# EAGLE design Rapide7seg (EAGLE 6.3)
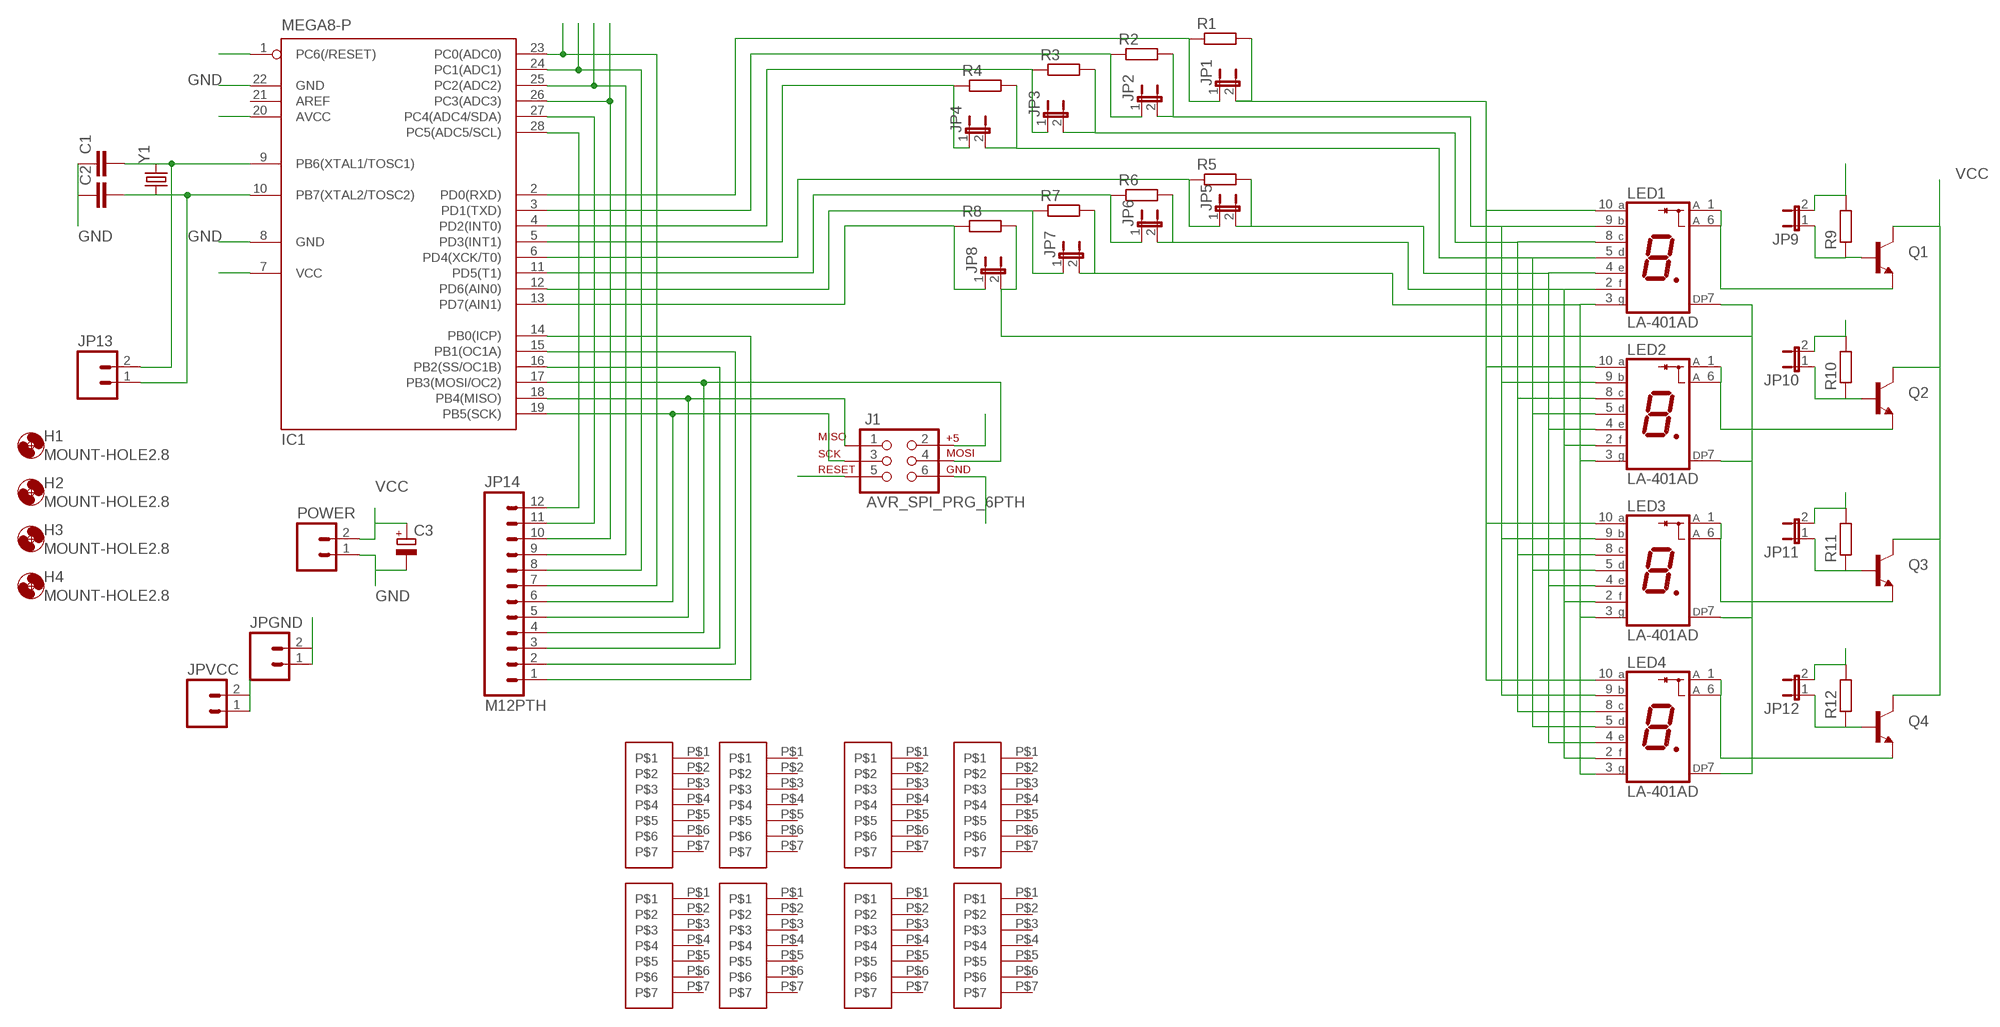
[diagram p0: schematic, sheet 1]

## Parts
C1  C-EU025-024X044  [C025-024X044]
C2  C-EU025-024X044  [C025-024X044]
C3  CPOL-EUE1.8-4  [E1,8-4]
H1  MOUNT-HOLE2.8  [2,8]
H2  MOUNT-HOLE2.8  [2,8]
H3  MOUNT-HOLE2.8  [2,8]
H4  MOUNT-HOLE2.8  [2,8]
IC1  MEGA8-P  [DIL28-3]
J1  AVR_SPI_PRG_6PTH  [2X3]
JP1  JUMPER-2SMD-NO  [SJ_2S-NO]
JP2  JUMPER-2SMD-NO  [SJ_2S-NO]
JP3  JUMPER-2SMD-NO  [SJ_2S-NO]
JP4  JUMPER-2SMD-NO  [SJ_2S-NO]
JP5  JUMPER-2SMD-NO  [SJ_2S-NO]
JP6  JUMPER-2SMD-NO  [SJ_2S-NO]
JP7  JUMPER-2SMD-NO  [SJ_2S-NO]
JP8  JUMPER-2SMD-NO  [SJ_2S-NO]
JP9  JUMPER-2SMD-NO  [SJ_2S-NO]
JP10  JUMPER-2SMD-NO  [SJ_2S-NO]
JP11  JUMPER-2SMD-NO  [SJ_2S-NO]
JP12  JUMPER-2SMD-NO  [SJ_2S-NO]
JP13  M02LOCK  [1X02_LOCK]
JP14  M12PTH  [1X12]
JPGND  M02PTH  [1X02]
JPVCC  M02PTH  [1X02]
LED1  LA-401AD  [LA-401]
LED2  LA-401AD  [LA-401]
LED3  LA-401AD  [LA-401]
LED4  LA-401AD  [LA-401]
POWER  M02LOCK_LONGPADS  [1X02_LOCK_LONGPADS]
Q1  TRANSISTOR_NPNTO92  [TO-92]
Q2  TRANSISTOR_NPNTO92  [TO-92]
Q3  TRANSISTOR_NPNTO92  [TO-92]
Q4  TRANSISTOR_NPNTO92  [TO-92]
R1  R-EU_0204/7  [0204/7]
R2  R-EU_0204/7  [0204/7]
R3  R-EU_0204/7  [0204/7]
R4  R-EU_0204/7  [0204/7]
R5  R-EU_0204/7  [0204/7]
R6  R-EU_0204/7  [0204/7]
R7  R-EU_0204/7  [0204/7]
R8  R-EU_0204/7  [0204/7]
R9  R-EU_0204/7  [0204/7]
R10  R-EU_0204/7  [0204/7]
R11  R-EU_0204/7  [0204/7]
R12  R-EU_0204/7  [0204/7]
U$1  M7_NOSILK  [M7_NOSILK]
U$2  M7_NOSILK  [M7_NOSILK]
U$3  M7_NOSILK  [M7_NOSILK]
U$4  M7_NOSILK  [M7_NOSILK]
U$5  M7_NOSILK  [M7_NOSILK]
U$6  M7_NOSILK  [M7_NOSILK]
U$7  M7_NOSILK  [M7_NOSILK]
U$8  M7_NOSILK  [M7_NOSILK]
Y1  CRYSTALHC49UV  [HC49U-V]

## Nets
GND: C1.1 C2.1 C3.- IC1.8(GND) IC1.22(GND) J1.6 JPGND.1 JPGND.2 POWER.1
L1: IC1.23(PC0(ADC0)) JP9.2 JP14.7 R9.2
L2: IC1.24(PC1(ADC1)) JP10.2 JP14.8 R10.2
L3: IC1.25(PC2(ADC2)) JP11.2 JP14.9 R11.2
L4: IC1.26(PC3(ADC3)) JP12.2 JP14.10 R12.2
N$1: C1.2 IC1.9(PB6(XTAL1/TOSC1)) JP13.2 Y1.2
N$2: C2.2 IC1.10(PB7(XTAL2/TOSC2)) JP13.1 Y1.1
N$3: IC1.18(PB4(MISO)) J1.1 JP14.5
N$4: IC1.19(PB5(SCK)) J1.3 JP14.6
N$5: IC1.17(PB3(MOSI/OC2)) J1.4 JP14.4
N$6: JP12.1 Q4.2(B) R12.1
N$7: JP11.1 Q3.2(B) R11.1
N$8: JP10.1 Q2.2(B) R10.1
N$9: JP1.2 LED1.10(A) LED2.10(A) LED3.10(A) LED4.10(A) R1.2
N$10: IC1.2(PD0(RXD)) JP1.1 R1.1
N$11: JP2.2 LED1.9(B) LED2.9(B) LED3.9(B) LED4.9(B) R2.2
N$12: IC1.3(PD1(TXD)) JP2.1 R2.1
N$13: JP3.2 LED1.8(C) LED2.8(C) LED3.8(C) LED4.8(C) R3.2
N$14: IC1.4(PD2(INT0)) JP3.1 R3.1
N$15: JP4.2 LED1.5(D) LED2.5(D) LED3.5(D) LED4.5(D) R4.2
N$16: IC1.5(PD3(INT1)) JP4.1 R4.1
N$17: IC1.13(PD7(AIN1)) JP8.1 R8.1
N$18: JP8.2 LED1.7(DP) LED2.7(DP) LED3.7(DP) LED4.7(DP) R8.2
N$19: IC1.12(PD6(AIN0)) JP7.1 R7.1
N$20: JP7.2 LED1.3(G) LED2.3(G) LED3.3(G) LED4.3(G) R7.2
N$21: IC1.11(PD5(T1)) JP6.1 R6.1
N$22: JP6.2 LED1.2(F) LED2.2(F) LED3.2(F) LED4.2(F) R6.2
N$23: IC1.6(PD4(XCK/T0)) JP5.1 R5.1
N$24: JP5.2 LED1.4(E) LED2.4(E) LED3.4(E) LED4.4(E) R5.2
N$25: LED1.1(A) LED1.6(A) Q1.1(E)
N$26: LED2.1(A) LED2.6(A) Q2.1(E)
N$27: LED3.1(A) LED3.6(A) Q3.1(E)
N$28: LED4.1(A) LED4.6(A) Q4.1(E)
N$29: JP9.1 Q1.2(B) R9.1
N$30: IC1.28(PC5(ADC5/SCL)) JP14.12
N$31: IC1.27(PC4(ADC4/SDA)) JP14.11
N$32: IC1.16(PB2(SS/OC1B)) JP14.3
N$33: IC1.15(PB1(OC1A)) JP14.2
N$34: IC1.14(PB0(ICP)) JP14.1
UCRESET: IC1.1(PC6(/RESET)) J1.5
VCC: C3.+ IC1.7(VCC) IC1.20(AVCC) J1.2 JPVCC.1 POWER.2 Q1.3(C) Q2.3(C) Q3.3(C) Q4.3(C)
Unconnected: IC1.21(AREF) JPVCC.2 U$1.P$1 U$1.P$2 U$1.P$3 U$1.P$4 U$1.P$5 U$1.P$6 U$1.P$7 U$2.P$1 U$2.P$2 U$2.P$3 U$2.P$4 U$2.P$5 U$2.P$6 U$2.P$7 U$3.P$1 U$3.P$2 U$3.P$3 U$3.P$4 U$3.P$5 U$3.P$6 U$3.P$7 U$4.P$1 U$4.P$2 U$4.P$3 U$4.P$4 U$4.P$5 U$4.P$6 U$4.P$7 U$5.P$1 U$5.P$2 U$5.P$3 U$5.P$4 U$5.P$5 U$5.P$6 U$5.P$7 U$6.P$1 U$6.P$2 U$6.P$3 U$6.P$4 U$6.P$5 U$6.P$6 U$6.P$7 U$7.P$1 U$7.P$2 U$7.P$3 U$7.P$4 U$7.P$5 U$7.P$6 U$7.P$7 U$8.P$1 U$8.P$2 U$8.P$3 U$8.P$4 U$8.P$5 U$8.P$6 U$8.P$7

## Library data of the parts
C1 C2 = resistor:C-EU: CAPACITOR, European symbol
C3 = resistor:CPOL-EU: POLARIZED CAPACITOR, European symbol
H1-H4 = holes:MOUNT-HOLE: MOUNTING HOLE with drill center marker
IC1 = atmel:MEGA8-P: MICROCONTROLLER 8 Kbytes FLASH, 1 kbytes SRAM, 512 bytes EEPROM, USART, 4-channel 10 bit ADC, 2-channel 8 bit ADC Pin compatible with Atmega48, ATMega88, ATMega168 Source: avr.lbr; OC_FARNELL: unknown; OC_NEWARK: unknown
J1 = SparkFun:AVR_SPI_PRG_6: AVR ISP 6 Pin This is the reduced ISP connector for AVR programming. Common on Arduino. This footprint will take up less PCB space and can be used with a 10-pin to 6-pin adapter such as SKU: BOB-08508
JP1-JP12 = SparkFun:JUMPER-2: Jumper Basic 0.1" spaced jumper. Use with breakaway headers.
JP13 JPGND JPVCC POWER = SparkFun:M02: Header 2 Standard 2-pin 0.1" header. Use with straight break away headers (SKU : PRT-00116), right angle break away headers (PRT-00553), swiss pins (PRT-00743), machine pins (PRT-00117), and female headers (PRT-00115). Molex polarized connector foot print use with SKU : PRT-08233 with associated crimp pins and housings.
JP14 = SparkFun:M12: Header 12 Standard 12-pin 0.1" header. Use with straight break away headers (SKU : PRT-00116), right angle break away headers (PRT-00553), swiss pins (PRT-00743), machine pins (PRT-00117), and female headers (PRT-00115).
LED1-LED4 = led-7-segment:LA-401*D: Single Digit LED Numeric Display (anode common) Source: ROHM .. la-1401dn.pdf; OC_FARNELL: unknown; OC_NEWARK: unknown
Q1-Q4 = SparkFun:TRANSISTOR_NPN: Transistor NPN BJT configuration in SOT23 package. MMBT2222 is the common NPN we use. Double check BCE configuration again layout.
R1-R12 = resistor:R-EU_: RESISTOR, European symbol
U$1-U$8 = kalshagar:M7_NOSILK
Y1 = SparkFun:CRYSTAL: Crystals Various standard crystals. Proven footprints. Spark Fun Electronics SKU : COM-00534

## Board
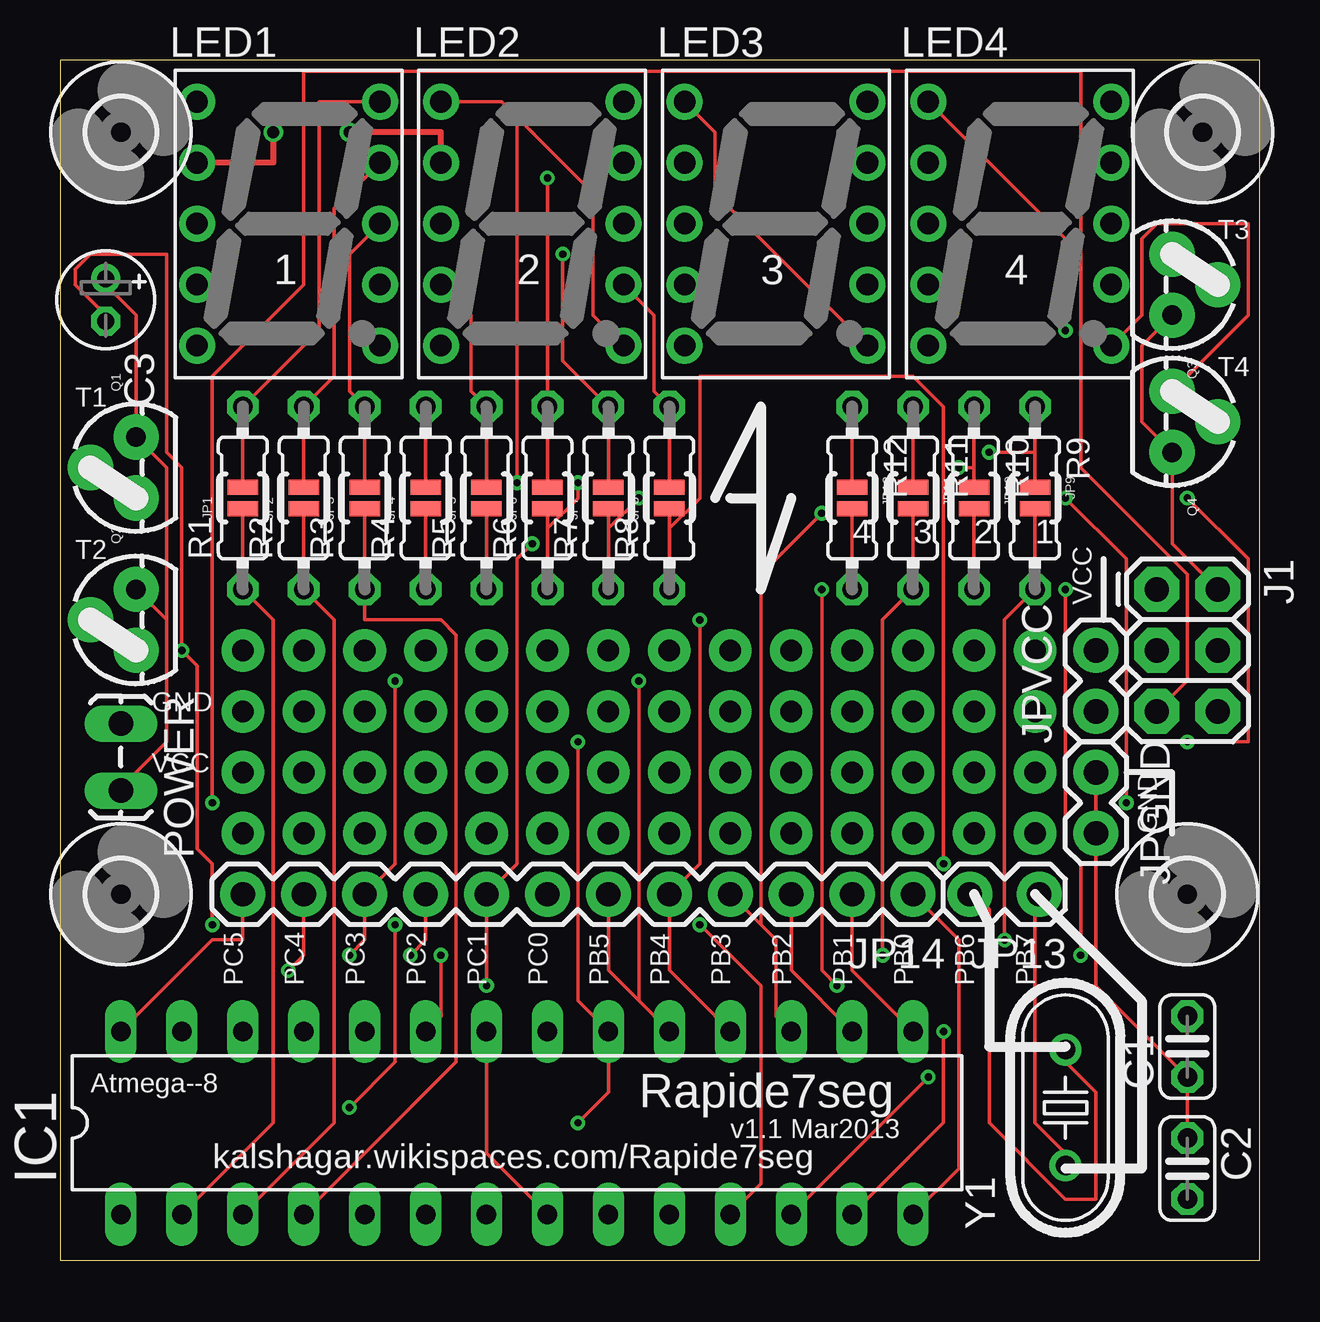
[diagram p1: board, top side]
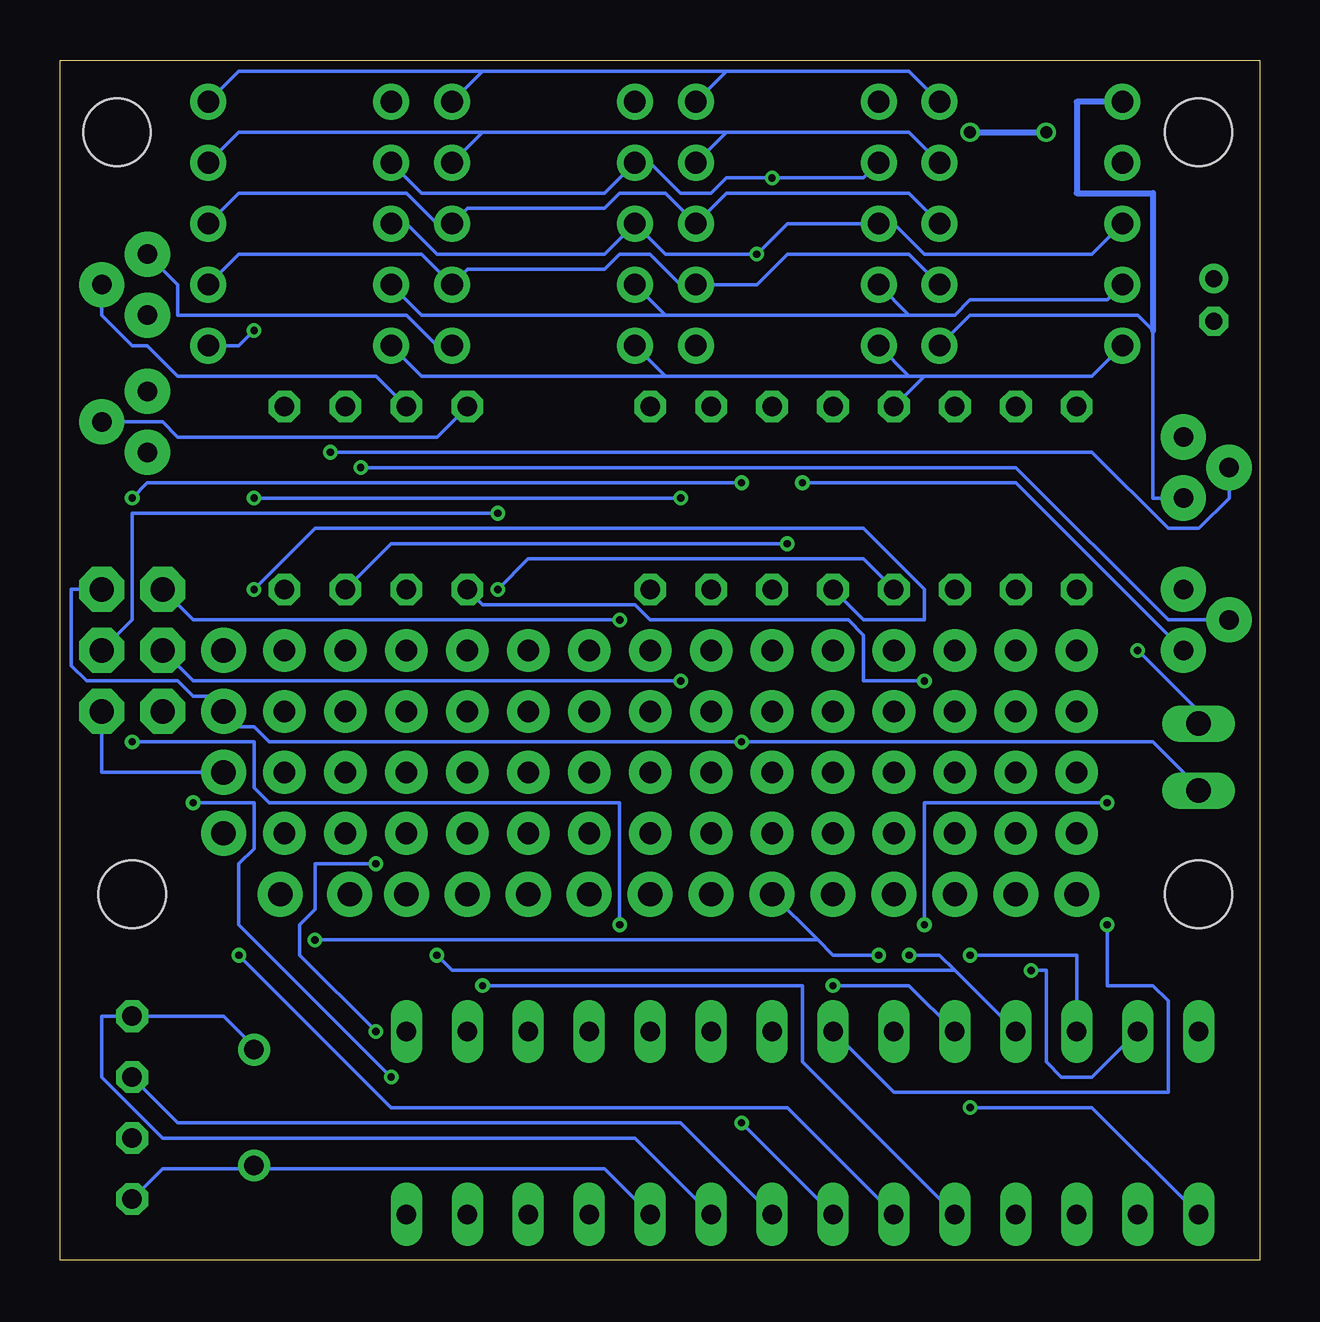
[diagram p2: board, bottom side, seen from below]

Size 50 x 50 mm. Coordinates in mm from the lower left corner, seen from the top.
Outline: 0,0 50,0 50,50 0,50 0,0
Copper layers (1*16): Top 0.035mm / dielectric 1.5mm / Bottom 0.035mm
Design rules "Fusion_eagle_rule_v1.1": minimum track width 6mil, minimum drill 12mil, track to track 6mil, track to pad 6mil, pad to pad 6mil, via to via 6mil, smd to smd 0mil, copper to edge 10mil, drill to drill 10mil, minimum pad ring 10mil, minimum via ring 6mil, stop-mask expansion 2mil, vias tented up to drill 100mil, thermal gap 10mil

### Footprints (pad centres in the part's own frame; a part is rotated, then mirrored left to right if it is on the bottom)
C025-024X044 = drill 0.813 octagon: 1 -1.27,0; 2 1.27,0
E1,8-4 = drill 0.711 pad 1.168: + -0.889,0 | drill 0.711 pad 1.168 octagon: - 0.889,0
2,8 = hole 2.8: 0,0
DIL28-3 = drill 0.813 long: 1 -16.51,-3.81; 2 -13.97,-3.81; 3 -11.43,-3.81; 4 -8.89,-3.81; 5 -6.35,-3.81; 6 -3.81,-3.81; 7 -1.27,-3.81; 8 1.27,-3.81; 9 3.81,-3.81; 10 6.35,-3.81; 11 8.89,-3.81; 12 11.43,-3.81; 13 13.97,-3.81; 14 16.51,-3.81; 15 16.51,3.81; 16 13.97,3.81; 17 11.43,3.81; 18 8.89,3.81; 19 6.35,3.81; 20 3.81,3.81; 21 1.27,3.81; 22 -1.27,3.81; 23 -3.81,3.81; 24 -6.35,3.81; 25 -8.89,3.81; 26 -11.43,3.81; 27 -13.97,3.81; 28 -16.51,3.81
2X3 = drill 1.016 pad 1.88 octagon: 1 0,0; 2 0,2.54; 3 2.54,0; 4 2.54,2.54; 5 5.08,0; 6 5.08,2.54
SJ_2S-NO = smd 0.635 x 1.27: 1 -0.45,0; 2 0.45,0
1X02_LOCK = drill 1.016 pad 1.88: 1 -0.178,0; 2 2.718,0
1X12 = drill 1.016 pad 1.88: 1 0,0; 2 2.54,0; 3 5.08,0; 4 7.62,0; 5 10.16,0; 6 12.7,0; 7 15.24,0; 8 17.78,0; 9 20.32,0; 10 22.86,0; 11 25.4,0; 12 27.94,0
1X02 = drill 1.016 pad 1.88: 1 0,0; 2 2.54,0
LA-401 = drill 0.9 pad 1.5: 1 -3.81,5.08; 2 -3.81,2.54; 3 -3.81,0; 4 -3.81,-2.54; 5 -3.81,-5.08; 6 3.81,-5.08; 7 3.81,-2.54; 8 3.81,0; 9 3.81,2.54; 10 3.81,5.08
1X02_LOCK_LONGPADS = drill 1.016 long: 1 -0.127,0; 2 2.667,0
TO-92 = drill 0.813 pad 1.88: 1 -1.27,0; 2 0,1.905; 3 1.27,0
0204/7 = drill 0.813 octagon: 1 -3.81,0; 2 3.81,0
M7_NOSILK = drill 0.9 pad 1.778: P$1 0,0; P$2 2.54,0; P$3 5.08,0; P$4 7.62,0; P$5 10.16,0; P$6 12.7,0; P$7 15.24,0
HC49U-V = drill 0.813: 1 -2.413,0; 2 2.413,0

### Placement (x,y rotation side)
C1  46.99,8.89 90 top
C2  46.99,3.81 270 top
C3  1.91,40.01 270 top
H1  47.62,46.99 0 top
H2  2.54,46.99 0 top
H3  46.99,15.24 0 top
H4  2.54,15.24 0 top
IC1  19.05,5.71 0 top
J1  45.72,27.94 270 top
JP1  7.62,31.75 90 top
JP2  10.16,31.75 90 top
JP3  12.7,31.75 90 top
JP4  15.24,31.75 90 top
JP5  17.78,31.75 90 top
JP6  20.32,31.75 90 top
JP7  22.86,31.75 90 top
JP8  25.4,31.75 90 top
JP9  40.64,31.75 270 top
JP10  38.1,31.75 270 top
JP11  35.56,31.75 270 top
JP12  33.02,31.75 270 top
JP13  40.64,15.24 180 top
JP14  35.56,15.24 180 top
JPGND  43.18,20.32 270 top
JPVCC  43.18,22.86 90 top
LED1  9.53,43.18 0 top
LED2  19.68,43.18 0 top
LED3  29.84,43.18 0 top
LED4  40.01,43.18 0 top
POWER  2.54,22.23 270 top
Q1  3.17,33.02 90 top
Q2  3.17,26.67 90 top
Q3  46.35,40.64 270 top
Q4  46.35,34.92 270 top
R1  7.62,31.75 90 top
R2  10.16,31.75 90 top
R3  12.7,31.75 90 top
R4  15.24,31.75 90 top
R5  17.78,31.75 90 top
R6  20.32,31.75 90 top
R7  22.86,31.75 90 top
R8  25.4,31.75 90 top
R9  40.64,31.75 270 top
R10  38.1,31.75 270 top
R11  35.56,31.75 270 top
R12  33.02,31.75 270 top
U$1  7.62,17.78 0 top
U$2  25.4,17.78 0 top
U$3  7.62,20.32 0 top
U$4  25.4,20.32 0 top
U$5  7.62,22.86 0 top
U$6  25.4,22.86 0 top
U$7  7.62,25.4 0 top
U$8  25.4,25.4 0 top
Y1  41.91,6.35 90 top

### Tracks (layer width: path | path; a pad name or v marks a point on that pad's centre or on a via)
GND  (via drill 0.3)
  Top 0.152: C3.- 1.91,39.37 0.64,40.64 0.64,41.27 1.27,41.91 4.45,41.91 4.45,33.66 5.08,33.02 v5.08,25.4 5.71,24.77 5.71,17.14 6.35,16.51 v6.35,13.97 | IC1.8 17.78,4.45 IC1.22 | C2.1 C1.1 43.18,11.43 JPGND.2 JPGND.1
  Bottom 0.152: v5.08,25.4 2.54,22.86 POWER.1 | J1.6 48.26,20.32 JPGND.1 | IC1.8 24.13,5.71 45.09,5.71 C1.1 | v6.35,13.97 6.35,11.43 4.45,11.43 3.81,10.79 3.81,6.99 15.24,6.99 IC1.22
L1  (via drill 0.3)
  Top 0.152: JP9.2 R9.2 39.37,26.67 v39.37,13.34 | IC1.23 15.88,10.16 v15.88,12.7
  Bottom 0.152: v15.88,12.7 17.78,12.7 18.41,13.34 | JP14.7 18.41,13.34 | 18.41,13.34 v39.37,13.34
L2  (via drill 0.3)
  Top 0.152: R10.2 JP10.2 | v17.78,11.43 JP14.8 19.05,16.51 19.05,29.21 v19.68,29.84
  Bottom 0.152: IC1.24 14.61,11.43 v17.78,11.43 | R10.2 36.2,29.84 v19.68,29.84
L3  (via drill 0.3)
  Top 0.152: JP11.2 R11.2 34.29,26.67 v34.29,12.7 | v14.61,12.7 15.24,13.34 JP14.9
  Bottom 0.152: 12.7,12.06 13.34,12.7 v14.61,12.7 | 12.7,12.06 IC1.25 | v34.29,12.7 33.66,12.06 12.7,12.06
L4  (via drill 0.3)
  Top 0.152: R12.2 JP12.2 | v12.06,12.7 12.7,13.34 JP14.10 13.97,16.51 v13.97,24.13
  Bottom 0.152: IC1.26 7.62,12.7 v12.06,12.7 | R12.2 32.38,27.3 26.04,27.3 25.4,26.67 17.14,26.67 16.51,26.04 16.51,24.13 v13.97,24.13
N$1
  Top 0.152: JP13.2 38.1,15.24 38.73,14.61 38.73,5.71 41.91,2.54 43.18,2.54 43.18,6.99 41.91,8.26 Y1.2
  Bottom 0.152: IC1.9 26.04,5.08 45.72,5.08 48.26,7.62 48.26,10.16 C1.2 43.18,10.16 41.91,8.89 Y1.2
N$2
  Top 0.152: JP13.1 40.64,15.24 40.64,5.71 41.91,4.45 Y1.1
  Bottom 0.152: IC1.10 27.3,3.81 41.91,3.81 | C2.2 45.72,3.81 41.91,3.81 | 41.91,3.81 Y1.1
N$3  (via drill 0.3)
  Top 0.152: IC1.18 25.4,12.06 JP14.5 26.67,16.51 v26.67,26.67
  Bottom 0.152: J1.1 44.45,26.67 v26.67,26.67
N$4  (via drill 0.3)
  Top 0.152: 24.13,10.79 22.86,12.06 JP14.6 | 24.13,10.79 IC1.19 | 24.13,10.79 v24.13,24.13
  Bottom 0.152: J1.3 44.45,24.13 v24.13,24.13
N$5  (via drill 0.3)
  Top 0.152: IC1.17 29.84,10.16 29.84,13.34 29.21,13.97 | JP14.4 29.21,13.97 | v31.75,31.11 29.21,28.57 29.21,13.97
  Bottom 0.152: J1.4 46.99,26.67 46.99,31.11 v31.75,31.11
N$6
  Top 0.152: R12.1 JP12.1
  Bottom 0.152: R12.1 34.29,34.29 45.09,34.29 45.72,34.92 Q4.2
N$7
  Top 0.152: R11.1 JP11.1
  Bottom 0.152: R11.1 36.83,36.83 45.09,36.83 46.35,38.1 46.99,38.1 48.26,39.37 Q3.2
N$8  (via drill 0.3)
  Top 0.152: R10.1 38.1,33.02 | 38.1,33.02 JP10.1 | v37.47,33.02 38.1,33.02
  Bottom 0.152: v37.47,33.02 10.16,33.02 3.81,26.67 Q2.2
N$9
  Top 0.152: JP1.2 R1.2 10.79,38.73 10.79,48.26 LED1.10
  Bottom 0.152: LED1.10 14.61,49.53 22.23,49.53 | LED2.10 22.23,49.53 | 32.38,49.53 LED3.10 | 22.23,49.53 32.38,49.53 | LED4.10 42.55,49.53 32.38,49.53
N$10
  Top 0.152: JP1.1 R1.1 8.89,26.67 8.89,5.71 IC1.2
N$11
  Top 0.152: JP2.2 R2.2 11.43,36.83 11.43,43.81 LED1.9
  Bottom 0.152: LED1.9 14.61,46.99 22.23,46.99 | LED2.9 22.23,46.99 | 32.38,46.99 LED3.9 | 22.23,46.99 32.38,46.99 | LED4.9 42.55,46.99 32.38,46.99
N$12
  Top 0.152: JP2.1 R2.1 11.43,26.67 11.43,5.71 IC1.3
N$13
  Top 0.152: JP3.2 R3.2 12.06,36.2 12.06,41.91 LED1.8
  Bottom 0.152: LED1.8 14.61,44.45 22.23,44.45 LED2.8 24.77,44.45 26.67,44.45 27.3,43.81 33.02,43.81 LED3.8 34.29,43.18 35.56,44.45 42.55,44.45 LED4.8
N$14
  Top 0.152: JP3.1 R3.1 12.7,26.67 15.88,26.67 16.51,26.04 16.51,8.26 IC1.4
N$15
  Top 0.152: R4.2 JP4.2
  Bottom 0.152: LED1.5 6.99,36.83 13.97,36.83 | R4.2 13.97,36.83 | 14.61,36.83 LED2.5 | 13.97,36.83 14.61,36.83 | 24.77,36.83 LED3.5 | 14.61,36.83 24.77,36.83 | LED4.5 34.92,36.83 24.77,36.83
N$16  (via drill 0.3)
  Top 0.152: R4.1 JP4.1 | v32.38,11.43 31.75,12.06 v31.75,27.94
  Bottom 0.152: IC1.5 19.05,8.26 19.05,11.43 v32.38,11.43 | v31.75,27.94 30.48,29.21 16.51,29.21 R4.1
N$17  (via drill 0.3)
  Top 0.152: R8.1 25.4,30.48 | 25.4,30.48 JP8.1 | IC1.13 36.83,5.71 v36.83,9.53 | v36.83,16.51 36.83,35.56 35.56,36.83 26.67,36.83 26.67,31.75 25.4,30.48
  Bottom 0.152: v36.83,9.53 40.01,12.7 40.01,13.97 39.37,14.61 39.37,16.51 v36.83,16.51
N$18
  Top 0.152: JP8.2 R8.2 24.77,36.2 24.77,39.37 LED2.7
  Bottom 0.152: LED4.7 42.55,41.91 34.92,41.91 LED3.7 33.02,41.27 27.3,41.27 26.67,41.91 25.4,41.91 24.13,40.64 LED2.7 20.95,40.64 19.68,41.91 14.61,41.91 LED1.7
N$19  (via drill 0.3)
  Top 0.152: R7.1 22.86,30.48 | 22.86,30.48 JP7.1 | v36.2,7.62 IC1.12 | v44.45,19.05 44.45,29.21 v41.91,31.75 | 22.86,30.48 v24.13,31.75
  Bottom 0.152: v36.2,7.62 42.55,13.97 42.55,16.51 41.91,17.14 41.91,19.05 v44.45,19.05 | v24.13,31.75 v41.91,31.75
N$20  (via drill 0.3)
  Top 0.152: JP7.2 R7.2 20.95,37.47 v20.95,41.91
  Bottom 0.152: LED4.3 35.56,43.18 34.29,41.91 27.3,41.91 LED3.3 24.77,41.91 v20.95,41.91 19.68,43.18 LED2.3 15.24,43.18 13.97,41.91 6.99,41.91 LED1.3
N$21  (via drill 0.3)
  Top 0.152: R6.1 20.32,30.48 | 20.32,30.48 JP6.1 | IC1.11 29.21,3.17 29.21,11.43 v26.67,13.97 | v46.99,21.59 49.53,21.59 49.53,29.21 v46.99,31.75 | v21.59,32.38 21.59,31.75 20.32,30.48
  Bottom 0.152: v26.67,13.97 26.67,19.05 41.27,19.05 41.91,19.68 41.91,21.59 v46.99,21.59 | v46.99,31.75 46.35,32.38 v21.59,32.38
N$22  (via drill 0.3, 0.5)
  Top 0.152: JP6.2 R6.2 v20.32,45.09
  Top 0.254: LED2.2 15.88,46.99 v12.06,46.99 | v8.89,46.99 8.89,45.72 LED1.2
  Bottom 0.152: LED2.2 16.51,45.09 v20.32,45.09 22.23,45.09 22.86,44.45 24.13,44.45 25.4,45.72 LED3.2 27.3,44.45 34.92,44.45 LED4.2
  Bottom 0.254: v12.06,46.99 v8.89,46.99
N$23  (via drill 0.3)
  Top 0.152: R5.1 JP5.1 | v42.55,12.7 42.55,16.51 41.91,17.14 v41.91,27.94
  Bottom 0.152: IC1.6 19.68,6.35 36.2,6.35 v42.55,12.7 | v41.91,27.94 39.37,30.48 16.51,30.48 13.97,27.94 13.97,26.67 16.51,26.67 R5.1
N$24
  Top 0.152: JP5.2 R5.2 17.14,36.2 17.14,39.37 LED2.4
  Bottom 0.152: LED1.4 6.35,40.01 12.06,40.01 12.7,39.37 14.61,39.37 | LED2.4 14.61,39.37 | 24.77,39.37 LED3.4 | 14.61,39.37 24.77,39.37 | LED4.4 34.92,39.37 24.77,39.37
N$25
  Bottom 0.152: LED1.6 12.06,39.37 5.08,39.37 4.45,38.73 4.45,31.75 Q1.1
  Bottom 0.254: LED1.1 7.62,48.26 7.62,44.45 4.45,44.45 4.45,38.73
N$26  (via drill 0.3)
  Top 0.152: LED2.6 22.23,39.37 22.23,44.45 19.05,47.62 | 19.05,47.62 18.41,48.26 LED2.1 | 19.05,47.62 v19.05,32.38
  Bottom 0.152: Q2.1 10.16,32.38 v19.05,32.38
N$27
  Top 0.152: LED3.6 27.3,44.45 27.3,46.99 LED3.1
  Bottom 0.152: Q3.1 45.09,40.64 45.09,39.37 35.56,39.37 34.29,38.1 LED3.6
N$28  (via drill 0.3)
  Top 0.152: LED4.6 45.09,39.37 45.09,42.55 45.72,43.18 49.53,43.18 49.53,39.37 Q4.1 | LED4.1 41.91,42.55 v41.91,38.73
  Bottom 0.152: v41.91,38.73 42.55,38.1 LED4.6
N$29  (via drill 0.3)
  Top 0.152: R9.1 40.64,33.66 | 40.64,33.66 JP9.1 | v38.73,33.66 40.64,33.66
  Bottom 0.152: v38.73,33.66 6.99,33.66 3.81,30.48 2.54,30.48 1.27,31.75 Q1.2
N$30
  Top 0.152: IC1.28 6.35,13.34 7.62,13.34 JP14.12
N$31  (via drill 0.3)
  Top 0.152: v9.53,12.06 10.16,12.7 JP14.11
  Bottom 0.152: IC1.27 6.99,7.62 8.26,7.62 8.89,8.26 8.89,12.06 v9.53,12.06
N$32
  Top 0.152: IC1.16 30.48,12.06 JP14.3
N$33
  Top 0.152: IC1.15 33.02,12.06 JP14.2
N$34
  Top 0.152: IC1.14 37.47,3.81 37.47,13.34 JP14.1
UCRESET  (via drill 0.3)
  Top 0.152: v12.06,6.35 13.97,8.26 v13.97,13.97 | v6.35,19.05 6.35,36.83 10.16,40.64 10.16,49.53 42.55,49.53 42.55,33.02 46.99,28.57 46.99,24.13 J1.5
  Bottom 0.152: IC1.1 6.99,6.35 v12.06,6.35 | v13.97,13.97 13.97,19.05 v6.35,19.05
VCC  (via drill 0.3)
  Top 0.152: J1.2 46.35,29.84 Q4.3 45.09,34.92 45.09,38.1 Q3.3 | v21.59,5.71 22.86,6.99 IC1.20 21.59,10.79 v21.59,21.59 | C3.+ 1.91,40.64 3.17,39.37 Q1.3 4.45,33.02 4.45,26.67 | 4.45,26.67 4.45,21.59 2.54,19.68 POWER.2 | Q2.3 4.45,26.67
  Bottom 0.152: J1.2 49.53,27.94 49.53,24.77 48.9,24.13 45.09,24.13 44.45,23.5 43.81,23.5 JPVCC.1 42.55,22.23 41.91,22.23 41.27,21.59 v21.59,21.59 4.45,21.59 2.54,19.68 POWER.2 | v21.59,5.71 IC1.7

### Text on the board
_tNames: T3 | 1 | 2 | 3 | 4 | T4 | T1 | 4 | 3 | 2 | 1 | T2 | VCC | GND | VCC | GND | PC5 | PC4 | PC3 | PC2 | PC1 | PC0 | PB5 | PB4 | PB3 | PB2 | PB1 | PB0 | PB6 | PB7 | Atmega--8 | Rapide7seg | v1.1 Mar2013 | kalshagar.wikispaces.com/Rapide7seg